# EAGLE design awg_v1 (EAGLE 5.11)
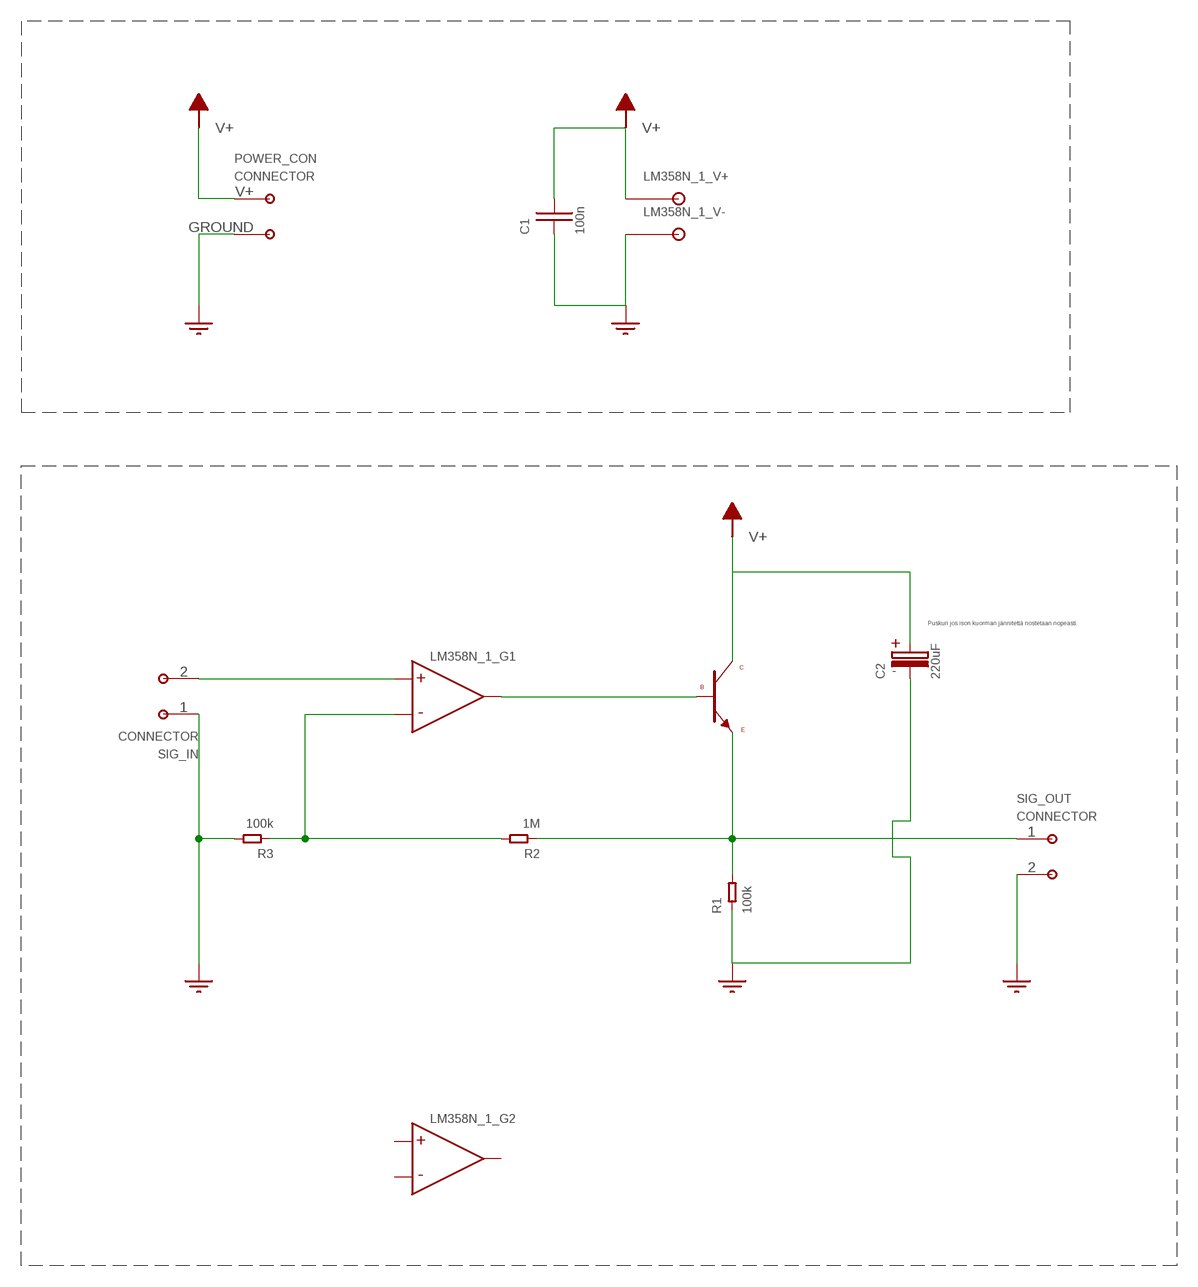
[diagram p0: schematic, sheet 1]

## Parts
C1  100n  C5MM_RASTER_FLAT  [C_5MM_RASTER_FLAT]
C2  220uF  C_POL  [E2,5-6]
LM358N_1  LM358DIL8  [DIL08]
POWER_CON  2_PIN_CONNECTOR  [2_PIN_GENERIC_POWER_CONNECTOR]
R1  100k  R12MM_RASTER_AXIAL  [0207/12]
R2  1M  R12MM_RASTER_AXIAL  [0207/12]
R3  100k  R12MM_RASTER_AXIAL  [0207/12]
SIG_IN  2_PIN_CONNECTORGENERIC  [2_PIN_CONNECTOR]
SIG_OUT  2_PIN_CONNECTORGENERIC  [2_PIN_CONNECTOR]
U$1  D1276A  [D1276A]

## Nets
GND: C1.P$2 C2.- LM358N_1.4(_V-:SUPPLYPIN) POWER_CON.GROUND R1.1 R3.2 SIG_IN.1 SIG_OUT.2
N$1: LM358N_1.1(_G1:OUT) U$1.1(B)
N$2: R1.2 R2.1 SIG_OUT.1 U$1.3(E)
N$3: LM358N_1.2(_G1:-) R2.2 R3.1
N$4: LM358N_1.3(_G1:+) SIG_IN.2
V+: C1.P$1 C2.+ LM358N_1.8(_V+:SUPPLYPIN) POWER_CON.V+ U$1.2(C)
Unconnected: LM358N_1.5(_G2:+) LM358N_1.6(_G2:-) LM358N_1.7(_G2:OUT)

## Notes on the sheet
- Puskuri jos ison kuorman jännitettä nostetaan nopeasti.

## Library data of the parts
C1 = library:C
C2 = library:C_POL
LM358N_1 = library:LM358
POWER_CON SIG_IN SIG_OUT = library:2_PIN_CONNECTOR
R1-R3 = library:R
U$1 = library:D1276A

## Board
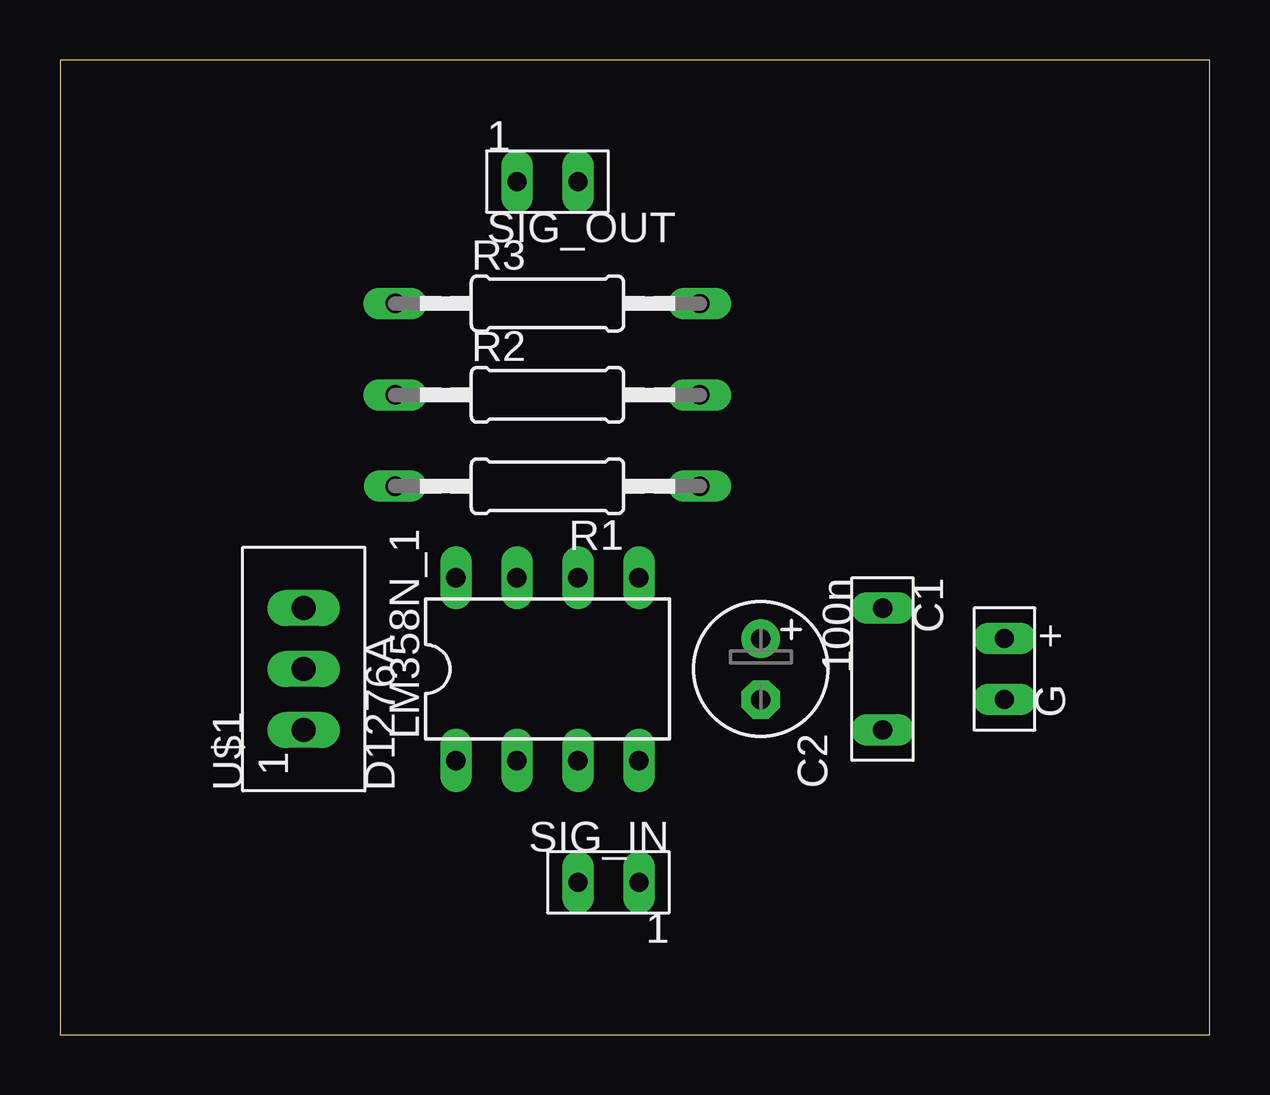
[diagram p1: board, top side]
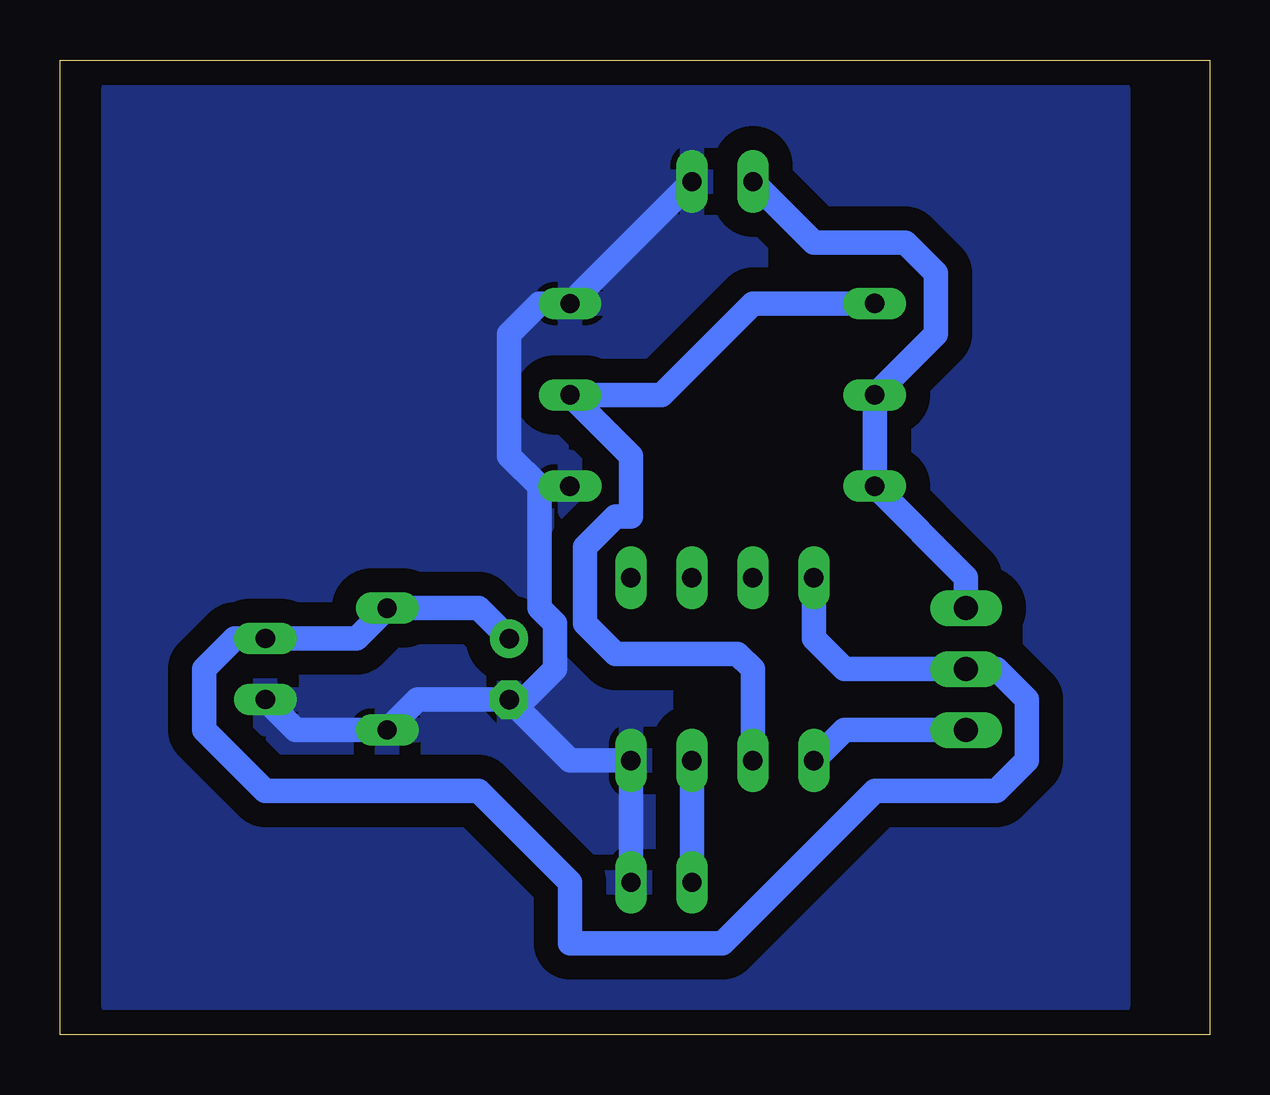
[diagram p2: board, bottom side, seen from below]

Size 47.93 x 40.63 mm. Coordinates in mm from the lower left corner, seen from the top.
Outline: 0,0 47.93,0 47.93,40.63 0,40.63 0,0
Copper layers (1*16): Top 0.035mm / dielectric 1.5mm / Bottom 0.035mm
Design rules "default *": minimum track width 10mil, minimum drill 24mil, track to track 1mm, track to pad 1mm, pad to pad 8mil, via to via 8mil, smd to smd 8mil, copper to edge 40mil, drill to drill 8mil, minimum pad ring 10mil, minimum via ring 8mil, stop-mask expansion 4mil, vias tented up to drill 0mil, thermal gap 10mil

### Footprints (pad centres in the part's own frame; a part is rotated, then mirrored left to right if it is on the bottom)
C_5MM_RASTER_FLAT = drill 0.8 long: P$1 -2.54,0; P$2 2.54,0
E2,5-6 = drill 0.813 pad 1.6 round: + -1.27,0 | drill 0.813 pad 1.6 octagon: - 1.27,0
DIL08 = drill 0.813 long: 1 -3.81,-3.81; 2 -1.27,-3.81; 3 1.27,-3.81; 4 3.81,-3.81; 5 3.81,3.81; 6 1.27,3.81; 7 -1.27,3.81; 8 -3.81,3.81
2_PIN_GENERIC_POWER_CONNECTOR = drill 0.8 long: GROUND 2.54,0; V+ 0,0
0207/12 = drill 0.813 long: 1 -6.35,0 | drill 0.8 long: 2 6.35,0
2_PIN_CONNECTOR = drill 0.8 long: 1 0,0; 2 2.54,0
D1276A = drill 1 long: 1 -2.54,0; 2 0,0; 3 2.54,0

### Placement (x,y rotation side)
C1  34.29,15.24 270 top
C2  29.21,15.24 270 top
LM358N_1  20.32,15.24 0 top
POWER_CON  39.37,16.51 270 top
R1  20.32,22.86 180 top
R2  20.32,26.67 0 top
R3  20.32,30.48 0 top
SIG_IN  24.13,6.35 180 top
SIG_OUT  19.05,35.56 0 top
U$1  10.16,15.24 90 top

### Tracks (layer width: path | path; a pad name or v marks a point on that pad's centre or on a via)
GND
  Bottom 1.016: SIG_OUT.2 R3.2 27.94,30.48 29.21,29.21 29.21,24.13 27.94,22.86 | 27.94,22.86 R1.1 | C2.- 26.67,11.43 LM358N_1.4 SIG_IN.1 | C2.- 33.02,13.97 C1.P$2 38.1,12.7 POWER_CON.GROUND | 27.94,22.86 27.94,17.78 27.3,17.14 27.3,15.24 28.57,13.97 C2.-
  pour Bottom: 3.81,39.37 3.81,1.27 45.72,1.27 45.72,39.37
N$1
  Bottom 1.016: LM358N_1.1 15.24,12.7 U$1.1
N$2
  Bottom 1.016: SIG_OUT.1 16.51,33.02 12.7,33.02 11.43,31.75 11.43,29.21 R2.1 R1.2 10.16,19.05 U$1.3
N$3
  Bottom 1.016: R3.1 19.05,30.48 22.86,26.67 R2.2 24.13,24.13 24.13,21.59 24.77,21.59 26.04,20.32 26.04,17.14 24.77,15.88 19.68,15.88 19.05,15.24 LM358N_1.2
N$4
  Bottom 1.016: SIG_IN.2 LM358N_1.3
V+
  Bottom 1.016: LM358N_1.8 16.51,16.51 15.24,15.24 U$1.2 8.89,15.24 7.62,13.97 7.62,11.43 8.89,10.16 13.97,10.16 20.32,3.81 26.67,3.81 26.67,6.35 30.48,10.16 39.37,10.16 41.91,12.7 41.91,15.24 40.64,16.51 POWER_CON.V+ 35.56,16.51 C1.P$1 30.48,17.78 C2.+